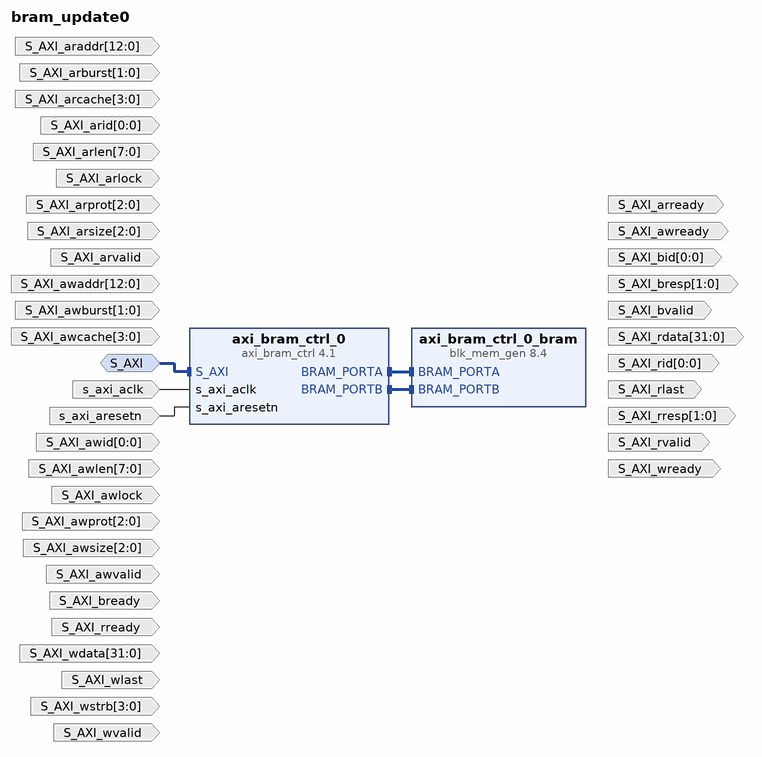
[diagram p0: block diagram of the top level]
# Vivado block design bram_update0, xczu7ev-ffvc1156-2-e, Vivado 2021.2
create_bd_design bram_update0

create_bd_intf_port -mode Slave -vlnv xilinx.com:interface:aximm_rtl:1.0 S_AXI
set_property -dict [list \
  CONFIG.ADDR_WIDTH 40 \
  CONFIG.ARUSER_WIDTH 0 \
  CONFIG.AWUSER_WIDTH 0 \
  CONFIG.BUSER_WIDTH 0 \
  CONFIG.CLK_DOMAIN design_1_zynq_ultra_ps_e_0_0_pl_clk0 \
  CONFIG.DATA_WIDTH 32 \
  CONFIG.FREQ_HZ 99990005 \
  CONFIG.HAS_BRESP 1 \
  CONFIG.HAS_BURST 1 \
  CONFIG.HAS_CACHE 1 \
  CONFIG.HAS_LOCK 1 \
  CONFIG.HAS_PROT 1 \
  CONFIG.HAS_QOS 0 \
  CONFIG.HAS_REGION 0 \
  CONFIG.HAS_RRESP 1 \
  CONFIG.HAS_WSTRB 1 \
  CONFIG.ID_WIDTH 1 \
  CONFIG.INSERT_VIP 0 \
  CONFIG.MAX_BURST_LENGTH 256 \
  CONFIG.NUM_READ_OUTSTANDING 2 \
  CONFIG.NUM_READ_THREADS 1 \
  CONFIG.NUM_WRITE_OUTSTANDING 2 \
  CONFIG.NUM_WRITE_THREADS 1 \
  CONFIG.PHASE 0.0 \
  CONFIG.PROTOCOL AXI4 \
  CONFIG.READ_WRITE_MODE READ_WRITE \
  CONFIG.RUSER_BITS_PER_BYTE 0 \
  CONFIG.RUSER_WIDTH 0 \
  CONFIG.SUPPORTS_NARROW_BURST 1 \
  CONFIG.WUSER_BITS_PER_BYTE 0 \
  CONFIG.WUSER_WIDTH 0 \
] [get_bd_intf_ports S_AXI]
create_bd_port -dir I -type clk s_axi_aclk
set_property -dict [list \
  CONFIG.ASSOCIATED_BUSIF S_AXI \
  CONFIG.ASSOCIATED_RESET s_axi_aresetn \
  CONFIG.CLK_DOMAIN design_1_zynq_ultra_ps_e_0_0_pl_clk0 \
  CONFIG.FREQ_HZ 99990005 \
  CONFIG.FREQ_TOLERANCE_HZ 0 \
  CONFIG.INSERT_VIP 0 \
  CONFIG.PHASE 0.0 \
] [get_bd_ports s_axi_aclk]
create_bd_port -dir I -type rst s_axi_aresetn
set_property -dict {CONFIG.INSERT_VIP 0 CONFIG.POLARITY ACTIVE_LOW} [get_bd_ports s_axi_aresetn]
create_bd_port -dir I -from 12 -to 0 S_AXI_araddr
create_bd_port -dir I -from 1 -to 0 S_AXI_arburst
create_bd_port -dir I -from 3 -to 0 S_AXI_arcache
create_bd_port -dir I -from 0 -to 0 S_AXI_arid
create_bd_port -dir I -from 7 -to 0 S_AXI_arlen
create_bd_port -dir I S_AXI_arlock
create_bd_port -dir I -from 2 -to 0 S_AXI_arprot
create_bd_port -dir O S_AXI_arready
create_bd_port -dir I -from 2 -to 0 S_AXI_arsize
create_bd_port -dir I S_AXI_arvalid
create_bd_port -dir I -from 12 -to 0 S_AXI_awaddr
create_bd_port -dir I -from 1 -to 0 S_AXI_awburst
create_bd_port -dir I -from 3 -to 0 S_AXI_awcache
create_bd_port -dir I -from 0 -to 0 S_AXI_awid
create_bd_port -dir I -from 7 -to 0 S_AXI_awlen
create_bd_port -dir I S_AXI_awlock
create_bd_port -dir I -from 2 -to 0 S_AXI_awprot
create_bd_port -dir O S_AXI_awready
create_bd_port -dir I -from 2 -to 0 S_AXI_awsize
create_bd_port -dir I S_AXI_awvalid
create_bd_port -dir O -from 0 -to 0 S_AXI_bid
create_bd_port -dir I S_AXI_bready
create_bd_port -dir O -from 1 -to 0 S_AXI_bresp
create_bd_port -dir O S_AXI_bvalid
create_bd_port -dir O -from 31 -to 0 S_AXI_rdata
create_bd_port -dir O -from 0 -to 0 S_AXI_rid
create_bd_port -dir O S_AXI_rlast
create_bd_port -dir I S_AXI_rready
create_bd_port -dir O -from 1 -to 0 S_AXI_rresp
create_bd_port -dir O S_AXI_rvalid
create_bd_port -dir I -from 31 -to 0 S_AXI_wdata
create_bd_port -dir I S_AXI_wlast
create_bd_port -dir O S_AXI_wready
create_bd_port -dir I -from 3 -to 0 S_AXI_wstrb
create_bd_port -dir I S_AXI_wvalid

create_bd_cell -type ip -vlnv xilinx.com:ip:axi_bram_ctrl:4.1 axi_bram_ctrl_0
create_bd_cell -type ip -vlnv xilinx.com:ip:blk_mem_gen:8.4 axi_bram_ctrl_0_bram
set_property -dict [list \
  CONFIG.Coe_File ../../../../../../ram_update0_axi_bram_ctrl_0_bram_0.coe \
  CONFIG.EN_SAFETY_CKT true \
  CONFIG.Enable_32bit_Address true \
  CONFIG.Load_Init_File true \
  CONFIG.Memory_Type True_Dual_Port_RAM \
  CONFIG.Register_PortA_Output_of_Memory_Primitives true \
  CONFIG.Register_PortB_Output_of_Memory_Primitives true \
  CONFIG.Use_RSTA_Pin true \
  CONFIG.Use_RSTB_Pin true \
  CONFIG.use_bram_block Stand_Alone \
] [get_bd_cells axi_bram_ctrl_0_bram]

# ---- connections ----

connect_bd_intf_net [get_bd_intf_ports S_AXI] [get_bd_intf_pins axi_bram_ctrl_0/S_AXI]
connect_bd_intf_net [get_bd_intf_pins axi_bram_ctrl_0_bram/BRAM_PORTA] [get_bd_intf_pins axi_bram_ctrl_0/BRAM_PORTA]
connect_bd_intf_net [get_bd_intf_pins axi_bram_ctrl_0_bram/BRAM_PORTB] [get_bd_intf_pins axi_bram_ctrl_0/BRAM_PORTB]
connect_bd_net [get_bd_ports s_axi_aclk] [get_bd_pins axi_bram_ctrl_0/s_axi_aclk]
connect_bd_net [get_bd_ports s_axi_aresetn] [get_bd_pins axi_bram_ctrl_0/s_axi_aresetn]

# ---- address map ----
assign_bd_address -offset 0x00A0010000 -range 8K -target_address_space [get_bd_addr_spaces S_AXI] [get_bd_addr_segs axi_bram_ctrl_0/S_AXI/Mem0]

validate_bd_design
save_bd_design
